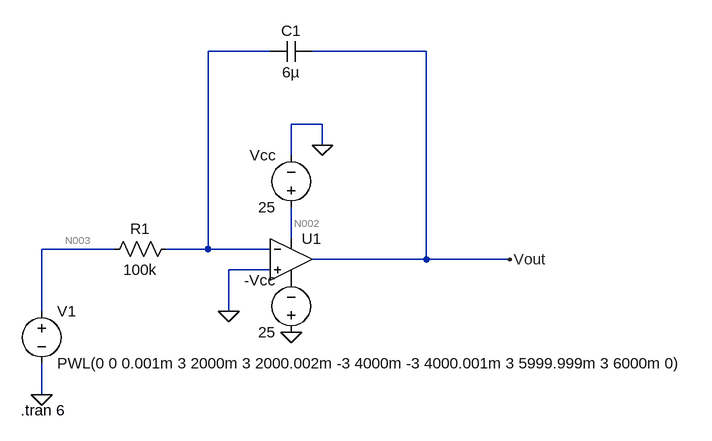
[diagram p0: schematic MurrayCarson_Prj02.asc]
MurrayCarson_Prj02.asc, the LTspice schematic file:
Version 4
SHEET 1 936 680
WIRE 208 -176 112 -176
WIRE 448 -176 272 -176
WIRE 288 -64 240 -64
WIRE 288 -32 288 -64
WIRE 240 -16 240 -64
WIRE 240 112 240 64
WIRE -32 128 -144 128
WIRE 112 128 112 -176
WIRE 112 128 48 128
WIRE 208 128 112 128
WIRE 448 144 448 -176
WIRE 448 144 272 144
WIRE 576 144 448 144
WIRE 208 160 144 160
WIRE -144 224 -144 128
WIRE 144 224 144 160
WIRE -144 352 -144 304
FLAG 288 -32 0
FLAG -144 352 0
FLAG 576 144 Vout
FLAG 144 224 0
FLAG 240 256 0
SYMBOL OpAmps\\UniversalOpamp2 240 144 R0
SYMATTR InstName U1
SYMBOL voltage 240 80 R180
WINDOW 0 24 96 Left 2
WINDOW 3 24 16 Left 2
WINDOW 123 0 0 Left 0
WINDOW 39 0 0 Left 0
SYMATTR InstName Vcc
SYMATTR Value 25
SYMBOL voltage -144 208 R0
WINDOW 123 0 0 Left 0
WINDOW 39 0 0 Left 0
SYMATTR InstName V1
SYMATTR Value PWL(0 0 0.001m 3 2000m 3 2000.002m -3 4000m -3 4000.001m 3 5999.999m 3 6000m 0)
SYMBOL res 64 112 R90
WINDOW 0 0 56 VBottom 2
WINDOW 3 32 56 VTop 2
SYMATTR InstName R1
SYMATTR Value 100k
SYMBOL cap 272 -192 R90
WINDOW 0 0 32 VBottom 2
WINDOW 3 32 32 VTop 2
SYMATTR InstName C1
SYMATTR Value 6µ
SYMBOL voltage 240 272 R180
WINDOW 0 24 96 Left 2
WINDOW 3 24 16 Left 2
SYMATTR InstName -Vcc
SYMATTR Value 25
TEXT -176 376 Left 2 !.tran 6

The netlist it stands for:
* MurrayCarson_Prj02.asc
XU1 0 N001 N002 P001 Vout level.2 Avol=1Meg GBW=10Meg Slew=10Meg ilimit=25m rail=0 Vos=0 phimargin=45 en=0 enk=0 in=0 ink=0 Rin=500Meg  ; pins IN+ IN- V+ V- OUT
Vcc N002 0 25
V1 N003 0 PWL(0 0 0.001m 3 2000m 3 2000.002m -3 4000m -3 4000.001m 3 5999.999m 3 6000m 0)
R1 N001 N003 100k
C1 Vout N001 6µ
V§-Vcc 0 P001 25
.tran 6
.lib UniversalOpamps2.sub
.backanno
.end

* Results of the author's LTspice run, read from the files saved beside the schematic
* Operating Point, zero values left out:
*   V(n002) = 25 V
*   V(p001) = -25 V
*   I(-vcc) = -2.492 mA
*   I(Vcc) = -2.492 mA
*   Ix(u1:3) = 2.492 mA
*   Ix(u1:4) = -2.492 mA
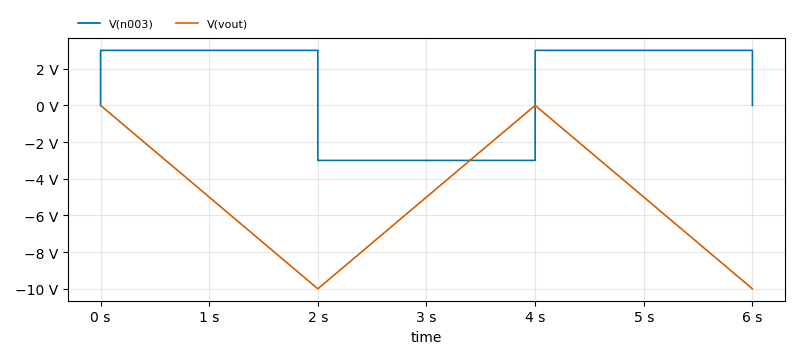
[diagram p1: Transient Analysis of MurrayCarson_Prj02.asc, plotted from the saved traces]
* Transient Analysis, 1 run:
*   V(n003): min -3 V, max 3 V, average 1 V, rms 3 V, last 0 V
*   V(vout): min -10 V, max 30.68 µV, average -5 V, rms 6.071 V, last -10 V